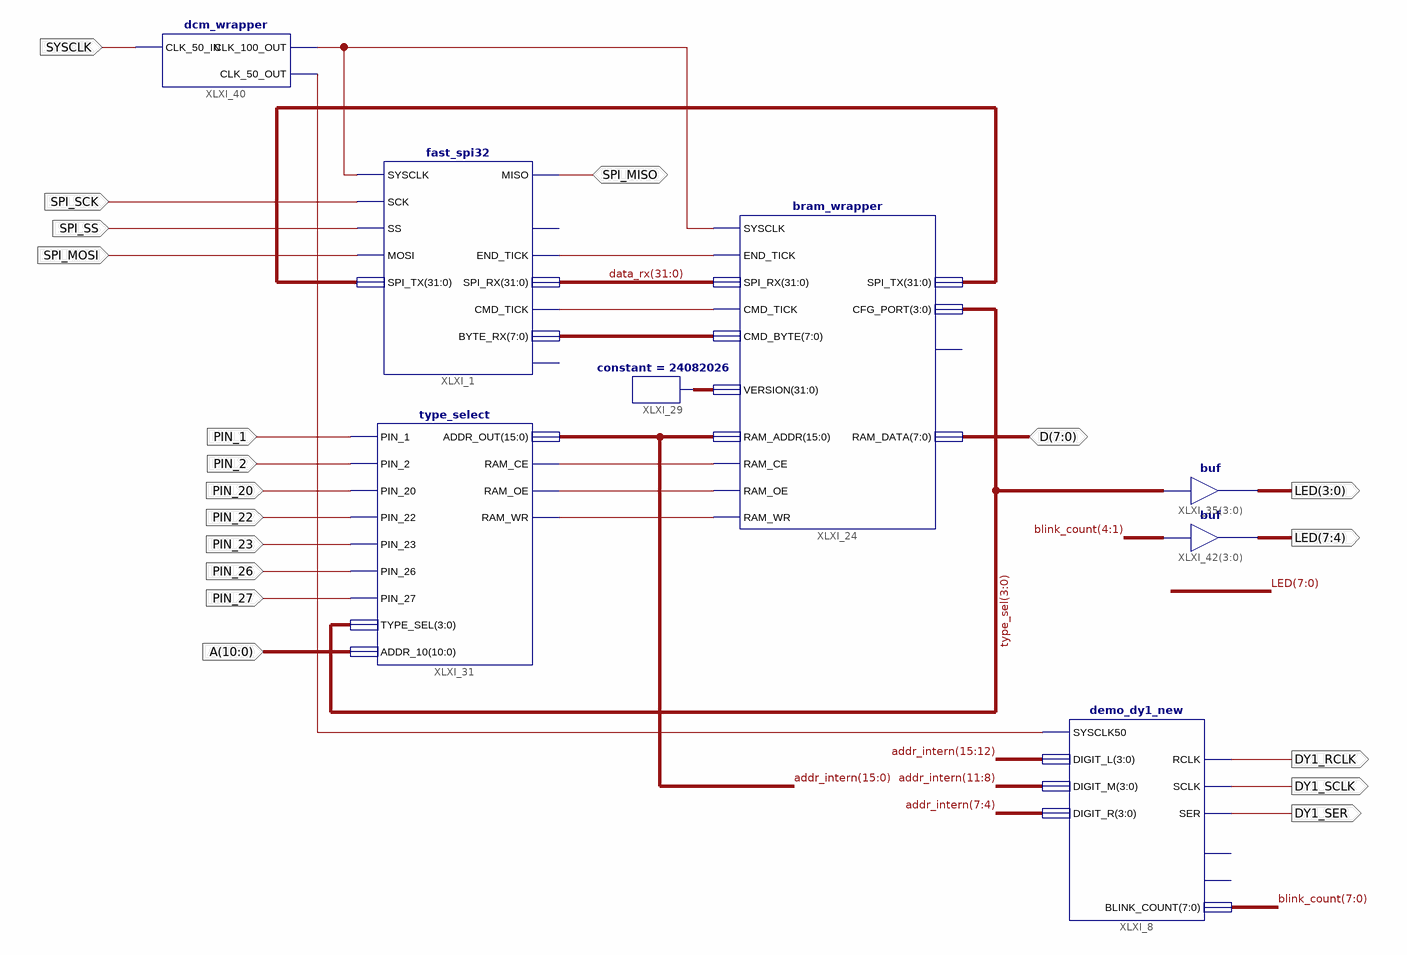
[diagram p0: schematic sheet 1]
// Xilinx ISE schematic fpga_main.sch (spartan6) as structural Verilog: 8 symbols, 19 ports
module fpga_main (
  input  SPI_MOSI,
  input  SPI_SS,
  input  SPI_SCK,
  input  PIN_1,
  input  PIN_2,
  input  PIN_20,
  input  PIN_22,
  input  PIN_23,
  input  PIN_26,
  input  PIN_27,
  input  [10:0] A,
  input  SYSCLK,
  inout  [7:0] D,
  inout  SPI_MISO,
  output DY1_RCLK,
  output DY1_SCLK,
  output DY1_SER,
  output [7:0] LED
);

  wire XLXN_150, XLXN_161, XLXN_170, XLXN_173, XLXN_175, XLXN_176, XLXN_178;
  wire [3:0] type_sel;
  wire [7:0] blink_count, XLXN_177;
  wire [15:0] addr_intern;
  wire [31:0] data_rx, XLXN_102, XLXN_105;

  fast_spi32 XLXI_1 (
    .SYSCLK(XLXN_150), .SCK(SPI_SCK), .SS(SPI_SS), .MOSI(SPI_MOSI), .SPI_TX(XLXN_102), .MISO(SPI_MISO),
    .CMD_TICK(XLXN_178), .END_TICK(XLXN_170), .SPI_RX(data_rx), .BYTE_RX(XLXN_177));  // open: START_TICK, BYTE_TICK
  bram_wrapper XLXI_24 (
    .SYSCLK(XLXN_150), .END_TICK(XLXN_170), .SPI_RX(data_rx), .SPI_TX(XLXN_102), .CFG_PORT(type_sel),
    .RAM_CE(XLXN_173), .RAM_OE(XLXN_175), .RAM_WR(XLXN_176), .RAM_DATA(D), .RAM_ADDR(addr_intern),
    .CMD_TICK(XLXN_178), .CMD_BYTE(XLXN_177), .VERSION(XLXN_105));  // open: RESET
  constant #(.CValue("24082026")) XLXI_29 (.O(XLXN_105));
  type_select XLXI_31 (
    .PIN_1(PIN_1), .PIN_2(PIN_2), .PIN_20(PIN_20), .PIN_22(PIN_22), .PIN_23(PIN_23), .PIN_26(PIN_26),
    .PIN_27(PIN_27), .TYPE_SEL(type_sel), .ADDR_10(A), .RAM_CE(XLXN_173), .RAM_OE(XLXN_175),
    .RAM_WR(XLXN_176), .ADDR_OUT(addr_intern));
  demo_dy1_new XLXI_8 (
    .SYSCLK50(XLXN_161), .RCLK(DY1_RCLK), .SCLK(DY1_SCLK), .SER(DY1_SER), .BLINK_COUNT(blink_count),
    .DIGIT_L(addr_intern[15:12]), .DIGIT_M(addr_intern[11:8]), .DIGIT_R(addr_intern[7:4]));  // open: LED_BLINK, TICK_12HZ
  assign LED[3:0] = type_sel;  // buf XLXI_35[3..0], 4 bits wide
  dcm_wrapper XLXI_40 (.CLK_50_IN(SYSCLK), .CLK_100_OUT(XLXN_150), .CLK_50_OUT(XLXN_161));
  assign LED[7:4] = blink_count[4:1];  // buf XLXI_42[3..0], 4 bits wide
endmodule
